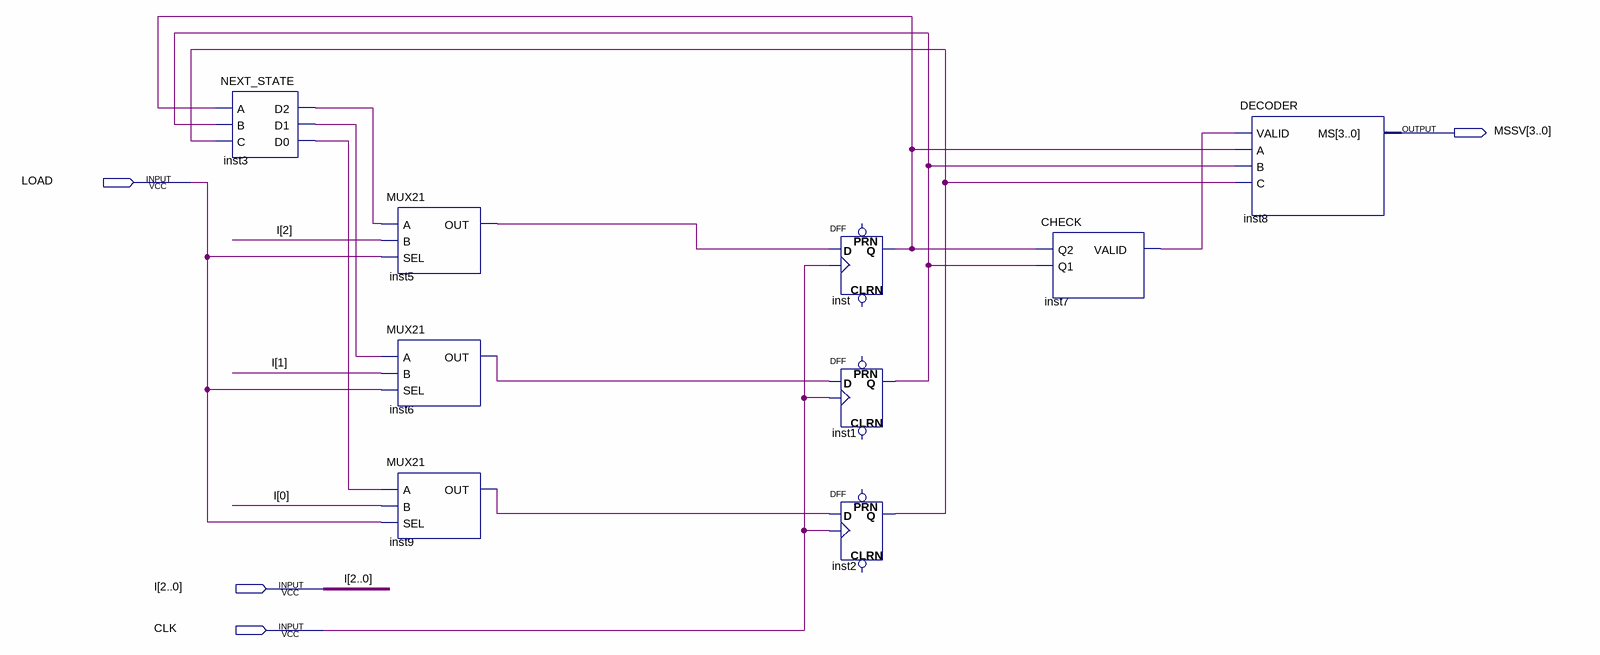
[diagram p0: schematic sheet]
// Quartus schematic Lab1_21521810_DB.bdf as structural Verilog: 9 symbols, 4 pins
module Lab1_21521810_DB (
  input  LOAD,
  input  [2:0] I,
  input  CLK,
  output [3:0] MSSV
);

  wire inst1_q, inst2_q, inst3_d0, inst3_d1, inst3_d2, inst5_out, inst6_out, inst7_valid, inst9_out, inst_q;

  NEXT_STATE inst3 (.A(inst_q), .B(inst1_q), .C(inst2_q), .D2(inst3_d2), .D1(inst3_d1), .D0(inst3_d0));
  MUX21 inst5 (.A(inst3_d2), .B(I[2]), .SEL(LOAD), .OUT(inst5_out));
  MUX21 inst6 (.A(inst3_d1), .B(I[1]), .SEL(LOAD), .OUT(inst6_out));
  MUX21 inst9 (.A(inst3_d0), .B(I[0]), .SEL(LOAD), .OUT(inst9_out));
  DFF inst (.CLK(CLK), .D(inst5_out), .Q(inst_q));  // open: CLRN, PRN
  DFF inst1 (.CLK(CLK), .D(inst6_out), .Q(inst1_q));  // open: CLRN, PRN
  DFF inst2 (.CLK(CLK), .D(inst9_out), .Q(inst2_q));  // open: CLRN, PRN
  CHECK inst7 (.Q2(inst_q), .Q1(inst1_q), .VALID(inst7_valid));
  DECODER inst8 (.VALID(inst7_valid), .A(inst_q), .B(inst1_q), .C(inst2_q), .MS(MSSV));
endmodule
